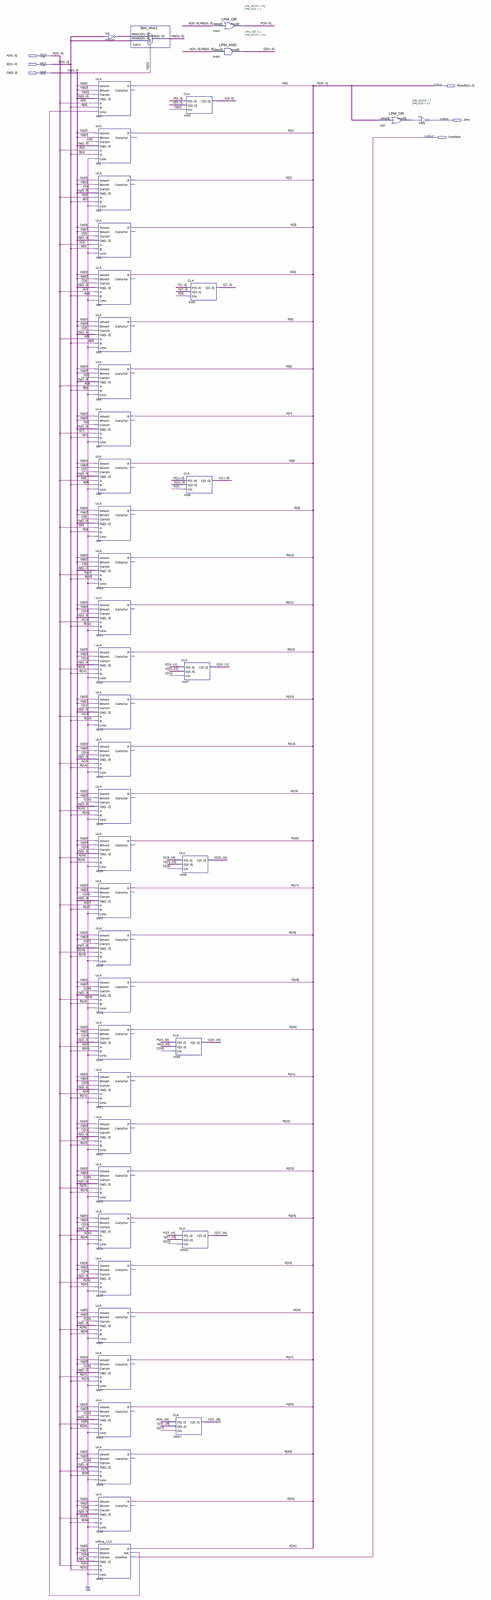
[diagram p0: schematic sheet, whole]
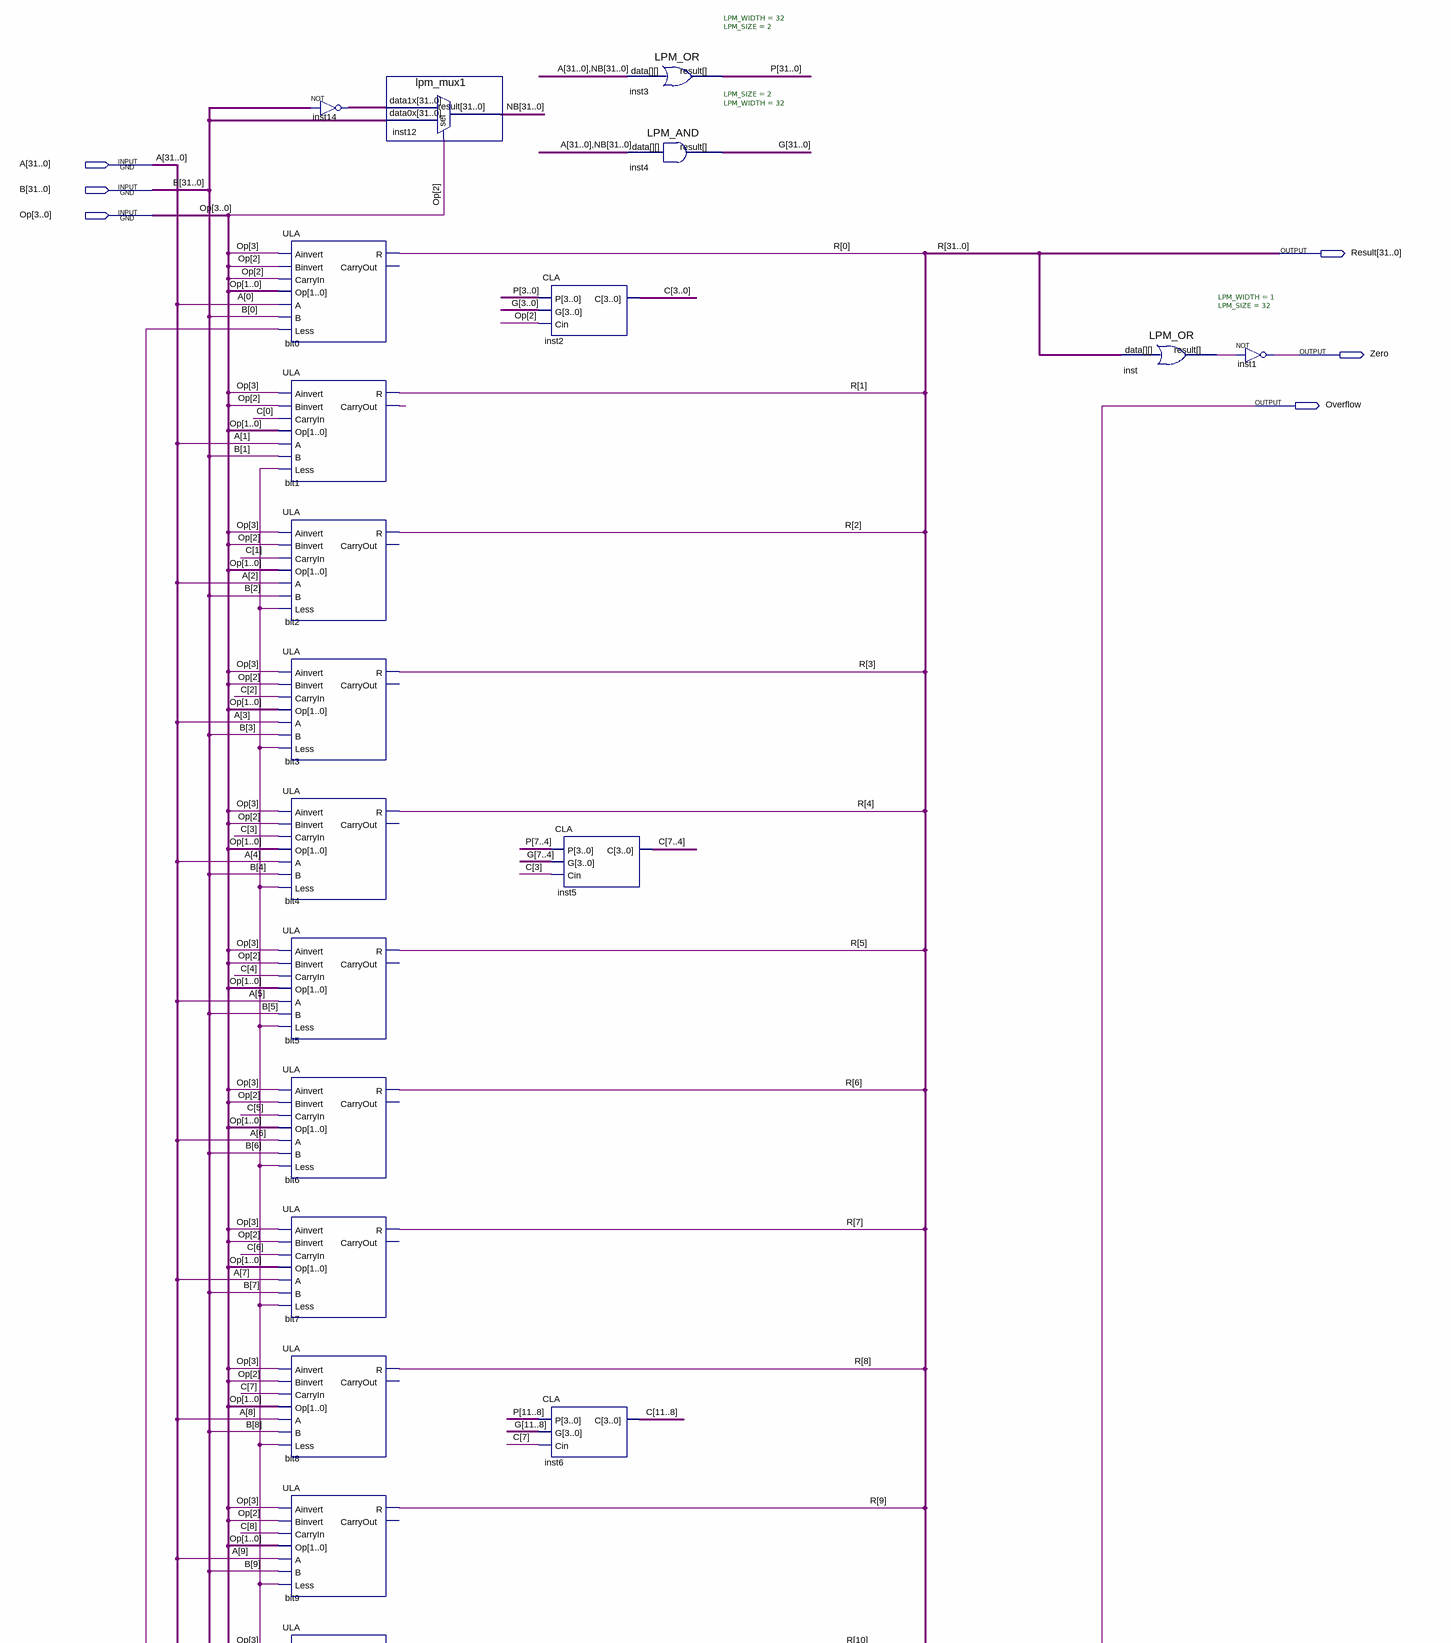
[diagram p1: schematic sheet, upper part]
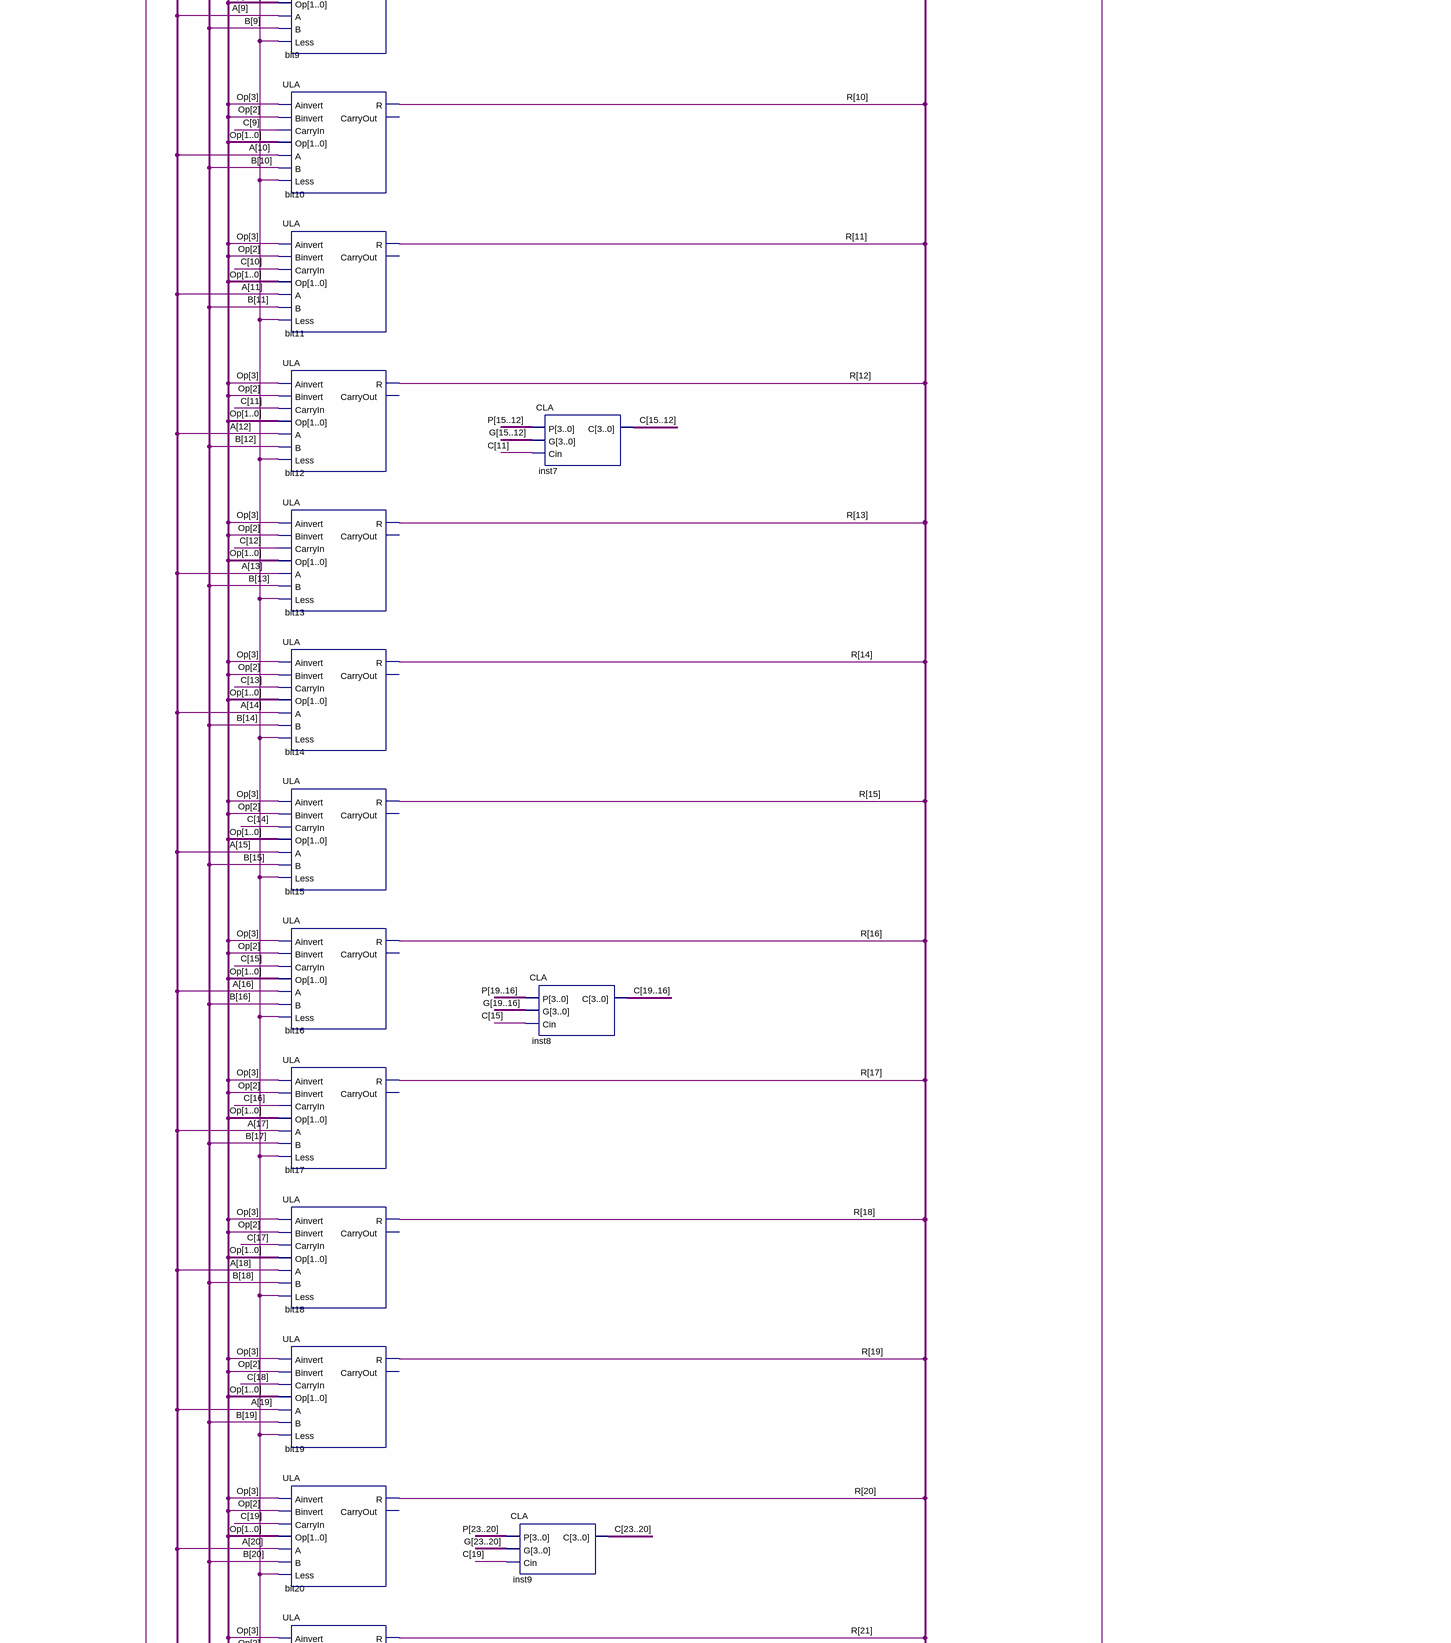
[diagram p2: schematic sheet, middle part]
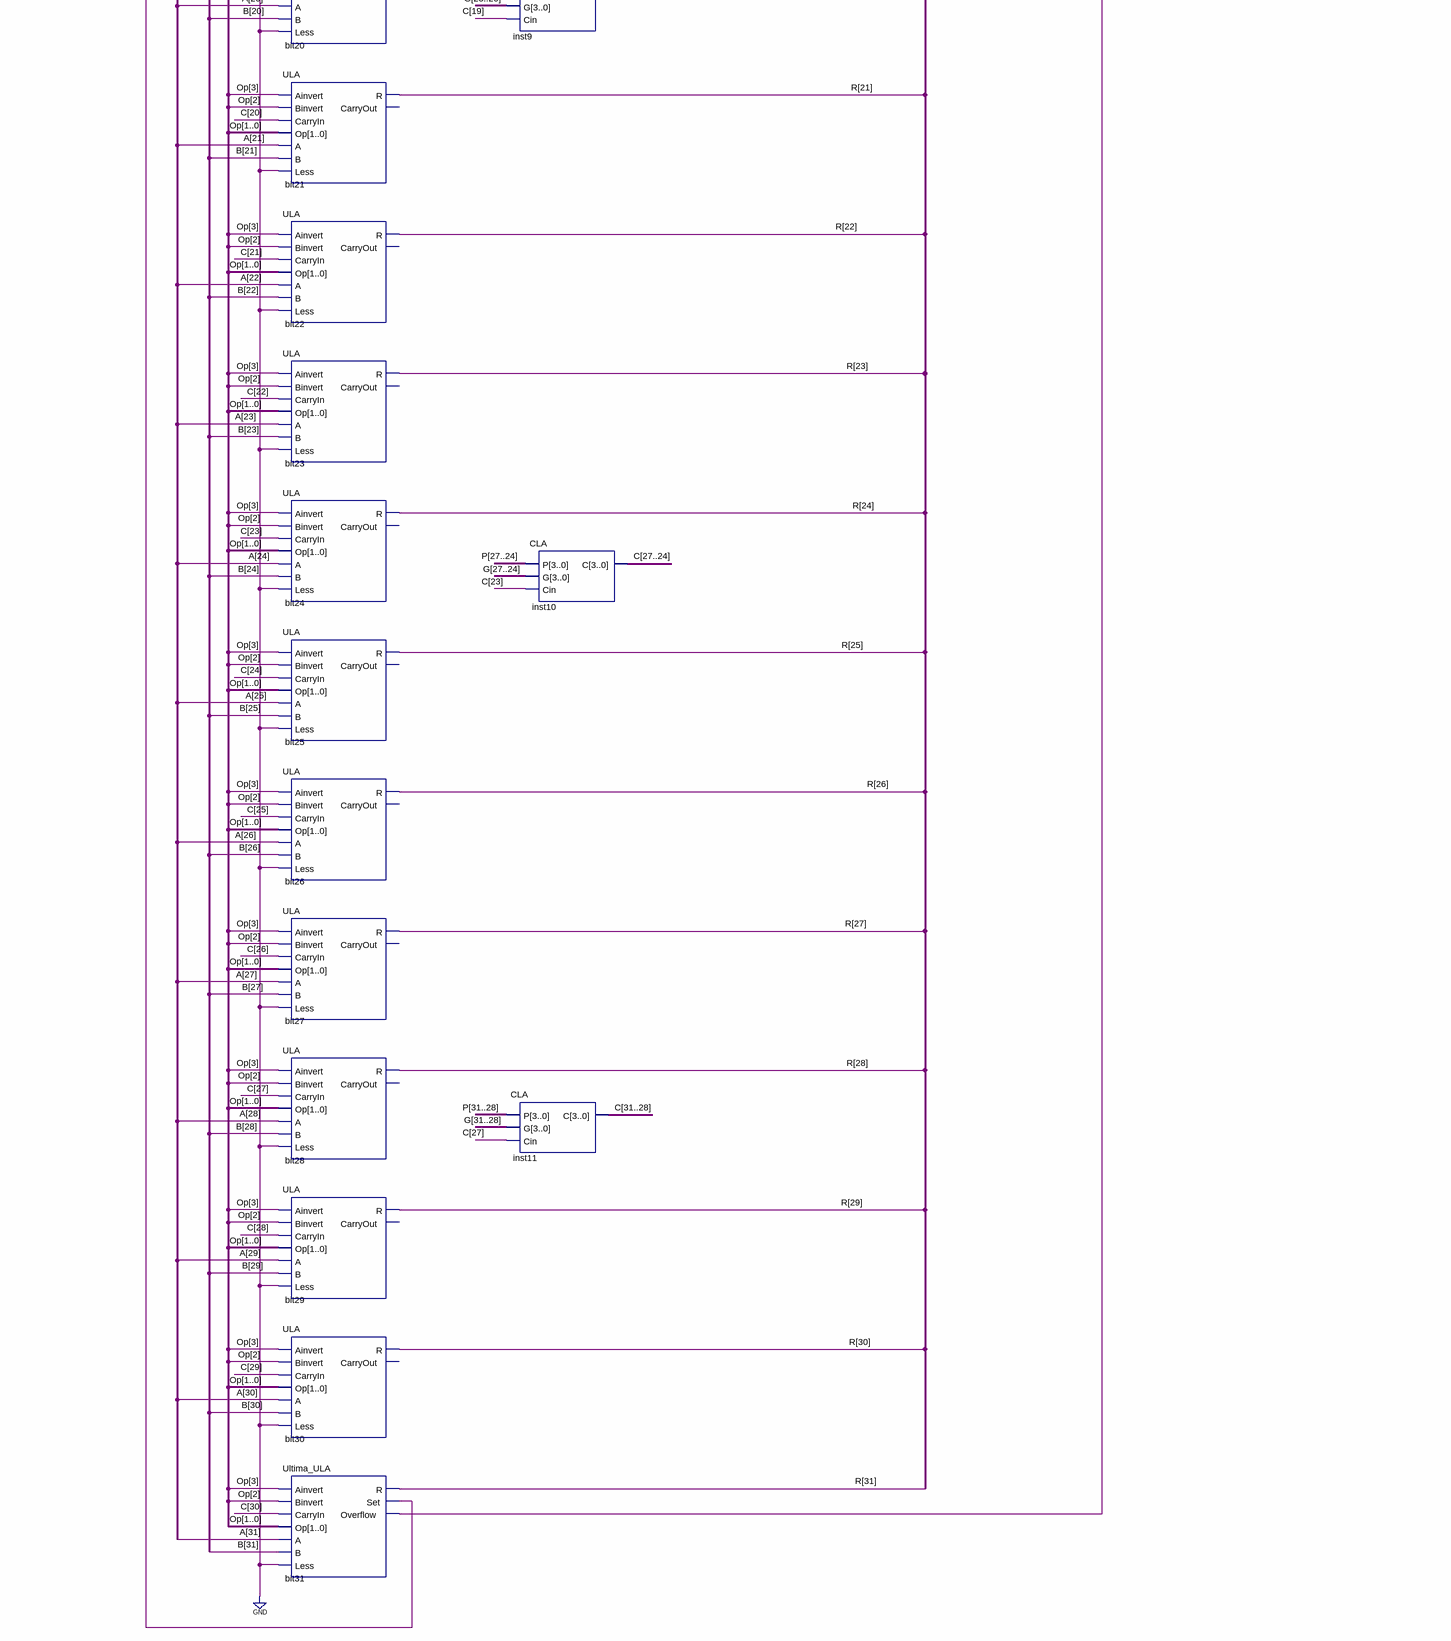
[diagram p3: schematic sheet, lower part]
// Quartus schematic ULA32.bdf as structural Verilog: 46 symbols, 6 pins
module ULA32 (
  input  [31:0] A,
  input  [31:0] B,
  input  [3:0] Op,
  output [31:0] Result,
  output Zero,
  output Overflow
);

  wire bit1_carryout, bit31_set, inst_result;
  wire [31:0] C, G, inst14_out, NB, P;

  assign inst14_out = ~B;  // NOT inst14, 32 bits wide
  ULA bit0 (
    .Ainvert(Op[3]), .Binvert(Op[2]), .CarryIn(Op[2]), .Op(Op[1:0]), .A(A[0]), .B(B[0]), .Less(bit31_set),
    .R(Result[0]));  // open: CarryOut
  ULA bit1 (
    .Ainvert(Op[3]), .Binvert(Op[2]), .CarryIn(C[0]), .Op(Op[1:0]), .A(A[1]), .B(B[1]), .Less(1'b0),
    .R(Result[1]), .CarryOut(bit1_carryout));
  ULA bit2 (
    .Ainvert(Op[3]), .Binvert(Op[2]), .CarryIn(C[1]), .Op(Op[1:0]), .A(A[2]), .B(B[2]), .Less(1'b0),
    .R(Result[2]));  // open: CarryOut
  ULA bit3 (
    .Ainvert(Op[3]), .Binvert(Op[2]), .CarryIn(C[2]), .Op(Op[1:0]), .A(A[3]), .B(B[3]), .Less(1'b0),
    .R(Result[3]));  // open: CarryOut
  ULA bit4 (
    .Ainvert(Op[3]), .Binvert(Op[2]), .CarryIn(C[3]), .Op(Op[1:0]), .A(A[4]), .B(B[4]), .Less(1'b0),
    .R(Result[4]));  // open: CarryOut
  ULA bit5 (
    .Ainvert(Op[3]), .Binvert(Op[2]), .CarryIn(C[4]), .Op(Op[1:0]), .A(A[5]), .B(B[5]), .Less(1'b0),
    .R(Result[5]));  // open: CarryOut
  ULA bit6 (
    .Ainvert(Op[3]), .Binvert(Op[2]), .CarryIn(C[5]), .Op(Op[1:0]), .A(A[6]), .B(B[6]), .Less(1'b0),
    .R(Result[6]));  // open: CarryOut
  ULA bit7 (
    .Ainvert(Op[3]), .Binvert(Op[2]), .CarryIn(C[6]), .Op(Op[1:0]), .A(A[7]), .B(B[7]), .Less(1'b0),
    .R(Result[7]));  // open: CarryOut
  ULA bit8 (
    .Ainvert(Op[3]), .Binvert(Op[2]), .CarryIn(C[7]), .Op(Op[1:0]), .A(A[8]), .B(B[8]), .Less(1'b0),
    .R(Result[8]));  // open: CarryOut
  ULA bit9 (
    .Ainvert(Op[3]), .Binvert(Op[2]), .CarryIn(C[8]), .Op(Op[1:0]), .A(A[9]), .B(B[9]), .Less(1'b0),
    .R(Result[9]));  // open: CarryOut
  ULA bit10 (
    .Ainvert(Op[3]), .Binvert(Op[2]), .CarryIn(C[9]), .Op(Op[1:0]), .A(A[10]), .B(B[10]), .Less(1'b0),
    .R(Result[10]));  // open: CarryOut
  ULA bit11 (
    .Ainvert(Op[3]), .Binvert(Op[2]), .CarryIn(C[10]), .Op(Op[1:0]), .A(A[11]), .B(B[11]), .Less(1'b0),
    .R(Result[11]));  // open: CarryOut
  ULA bit12 (
    .Ainvert(Op[3]), .Binvert(Op[2]), .CarryIn(C[11]), .Op(Op[1:0]), .A(A[12]), .B(B[12]), .Less(1'b0),
    .R(Result[12]));  // open: CarryOut
  ULA bit13 (
    .Ainvert(Op[3]), .Binvert(Op[2]), .CarryIn(C[12]), .Op(Op[1:0]), .A(A[13]), .B(B[13]), .Less(1'b0),
    .R(Result[13]));  // open: CarryOut
  ULA bit14 (
    .Ainvert(Op[3]), .Binvert(Op[2]), .CarryIn(C[13]), .Op(Op[1:0]), .A(A[14]), .B(B[14]), .Less(1'b0),
    .R(Result[14]));  // open: CarryOut
  ULA bit15 (
    .Ainvert(Op[3]), .Binvert(Op[2]), .CarryIn(C[14]), .Op(Op[1:0]), .A(A[15]), .B(B[15]), .Less(1'b0),
    .R(Result[15]));  // open: CarryOut
  ULA bit16 (
    .Ainvert(Op[3]), .Binvert(Op[2]), .CarryIn(C[15]), .Op(Op[1:0]), .A(A[16]), .B(B[16]), .Less(1'b0),
    .R(Result[16]));  // open: CarryOut
  ULA bit17 (
    .Ainvert(Op[3]), .Binvert(Op[2]), .CarryIn(C[16]), .Op(Op[1:0]), .A(A[17]), .B(B[17]), .Less(1'b0),
    .R(Result[17]));  // open: CarryOut
  ULA bit18 (
    .Ainvert(Op[3]), .Binvert(Op[2]), .CarryIn(C[17]), .Op(Op[1:0]), .A(A[18]), .B(B[18]), .Less(1'b0),
    .R(Result[18]));  // open: CarryOut
  ULA bit19 (
    .Ainvert(Op[3]), .Binvert(Op[2]), .CarryIn(C[18]), .Op(Op[1:0]), .A(A[19]), .B(B[19]), .Less(1'b0),
    .R(Result[19]));  // open: CarryOut
  ULA bit20 (
    .Ainvert(Op[3]), .Binvert(Op[2]), .CarryIn(C[19]), .Op(Op[1:0]), .A(A[20]), .B(B[20]), .Less(1'b0),
    .R(Result[20]));  // open: CarryOut
  ULA bit21 (
    .Ainvert(Op[3]), .Binvert(Op[2]), .CarryIn(C[20]), .Op(Op[1:0]), .A(A[21]), .B(B[21]), .Less(1'b0),
    .R(Result[21]));  // open: CarryOut
  ULA bit22 (
    .Ainvert(Op[3]), .Binvert(Op[2]), .CarryIn(C[21]), .Op(Op[1:0]), .A(A[22]), .B(B[22]), .Less(1'b0),
    .R(Result[22]));  // open: CarryOut
  ULA bit23 (
    .Ainvert(Op[3]), .Binvert(Op[2]), .CarryIn(C[22]), .Op(Op[1:0]), .A(A[23]), .B(B[23]), .Less(1'b0),
    .R(Result[23]));  // open: CarryOut
  ULA bit24 (
    .Ainvert(Op[3]), .Binvert(Op[2]), .CarryIn(C[23]), .Op(Op[1:0]), .A(A[24]), .B(B[24]), .Less(1'b0),
    .R(Result[24]));  // open: CarryOut
  ULA bit25 (
    .Ainvert(Op[3]), .Binvert(Op[2]), .CarryIn(C[24]), .Op(Op[1:0]), .A(A[25]), .B(B[25]), .Less(1'b0),
    .R(Result[25]));  // open: CarryOut
  ULA bit26 (
    .Ainvert(Op[3]), .Binvert(Op[2]), .CarryIn(C[25]), .Op(Op[1:0]), .A(A[26]), .B(B[26]), .Less(1'b0),
    .R(Result[26]));  // open: CarryOut
  ULA bit27 (
    .Ainvert(Op[3]), .Binvert(Op[2]), .CarryIn(C[26]), .Op(Op[1:0]), .A(A[27]), .B(B[27]), .Less(1'b0),
    .R(Result[27]));  // open: CarryOut
  ULA bit28 (
    .Ainvert(Op[3]), .Binvert(Op[2]), .CarryIn(C[27]), .Op(Op[1:0]), .A(A[28]), .B(B[28]), .Less(1'b0),
    .R(Result[28]));  // open: CarryOut
  ULA bit29 (
    .Ainvert(Op[3]), .Binvert(Op[2]), .CarryIn(C[28]), .Op(Op[1:0]), .A(A[29]), .B(B[29]), .Less(1'b0),
    .R(Result[29]));  // open: CarryOut
  ULA bit30 (
    .Ainvert(Op[3]), .Binvert(Op[2]), .CarryIn(C[29]), .Op(Op[1:0]), .A(A[30]), .B(B[30]), .Less(1'b0),
    .R(Result[30]));  // open: CarryOut
  Ultima_ULA bit31 (
    .Ainvert(Op[3]), .Binvert(Op[2]), .CarryIn(C[30]), .Op(Op[1:0]), .A(A[31]), .B(B[31]), .Less(1'b0),
    .R(Result[31]), .Set(bit31_set), .Overflow(Overflow));
  lpm_mux1 inst12 (.data1x(inst14_out), .data0x(B), .sel(Op[2]), .result(NB));
  CLA inst9 (.P(P[23:20]), .G(G[23:20]), .Cin(C[19]), .C(C[23:20]));
  CLA inst11 (.P(P[31:28]), .G(G[31:28]), .Cin(C[27]), .C(C[31:28]));
  CLA inst2 (.P(P[3:0]), .G(G[3:0]), .Cin(Op[2]), .C(C[3:0]));
  CLA inst5 (.P(P[7:4]), .G(G[7:4]), .Cin(C[3]), .C(C[7:4]));
  CLA inst6 (.P(P[11:8]), .G(G[11:8]), .Cin(C[7]), .C(C[11:8]));
  CLA inst7 (.P(P[15:12]), .G(G[15:12]), .Cin(C[11]), .C(C[15:12]));
  CLA inst8 (.P(P[19:16]), .G(G[19:16]), .Cin(C[15]), .C(C[19:16]));
  CLA inst10 (.P(P[27:24]), .G(G[27:24]), .Cin(C[23]), .C(C[27:24]));
  LPM_OR #(.LPM_WIDTH(32), .LPM_SIZE(2)) inst3 (.data({A, NB}), .result(P));
  LPM_AND #(.LPM_SIZE(2), .LPM_WIDTH(32)) inst4 (.data({A, NB}), .result(G));
  LPM_OR #(.LPM_WIDTH(1), .LPM_SIZE(32)) inst (.data(Result), .result(inst_result));
  not inst1 (Zero, inst_result);

  // Other names for the same wires on the sheet: R[31:0] = Result
endmodule
